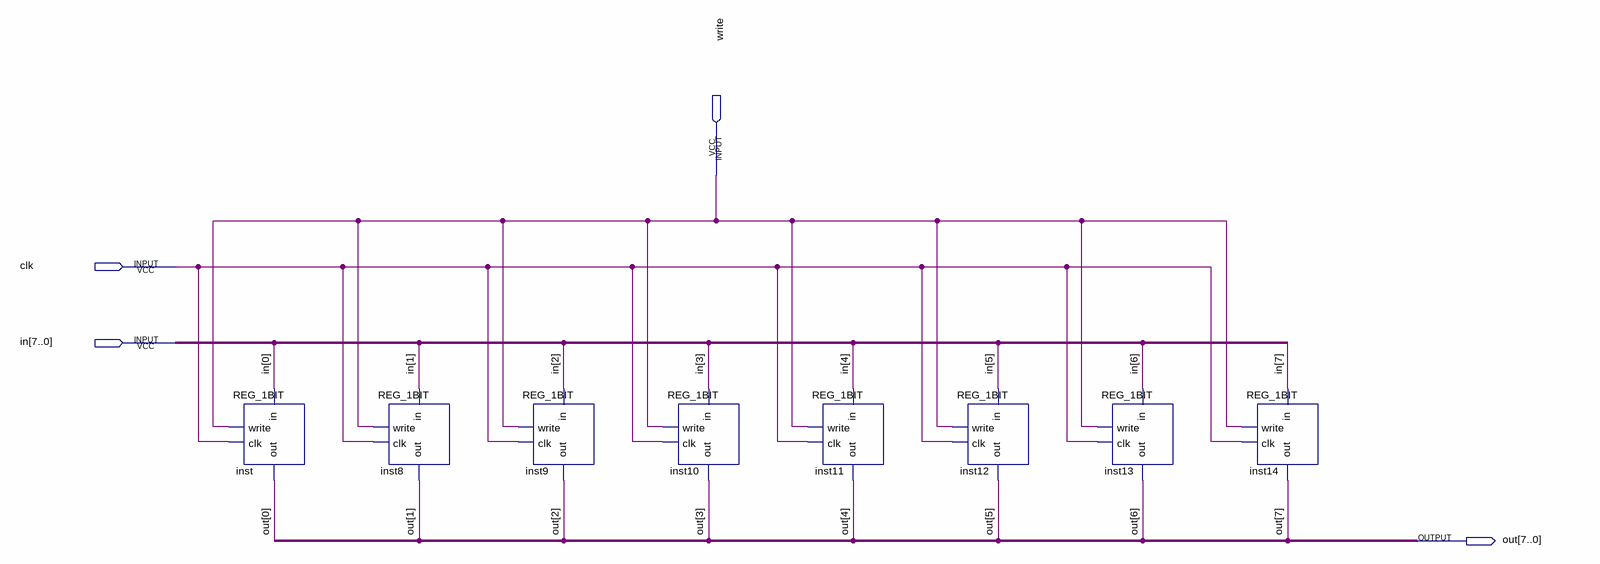
[diagram p0: schematic sheet]
// Quartus schematic REG_1BYTE.bdf as structural Verilog: 8 symbols, 4 pins
module REG_1BYTE (
  input  write,
  input  clk,
  input  [7:0] in,
  output [7:0] out
);

  REG_1BIT inst (.in(in[0]), .write(write), .clk(clk), .out(out[0]));
  REG_1BIT inst8 (.in(in[1]), .write(write), .clk(clk), .out(out[1]));
  REG_1BIT inst9 (.in(in[2]), .write(write), .clk(clk), .out(out[2]));
  REG_1BIT inst10 (.in(in[3]), .write(write), .clk(clk), .out(out[3]));
  REG_1BIT inst11 (.in(in[4]), .write(write), .clk(clk), .out(out[4]));
  REG_1BIT inst12 (.in(in[5]), .write(write), .clk(clk), .out(out[5]));
  REG_1BIT inst13 (.in(in[6]), .write(write), .clk(clk), .out(out[6]));
  REG_1BIT inst14 (.in(in[7]), .write(write), .clk(clk), .out(out[7]));
endmodule
